# EAGLE design PiSmoker_sig_v1.1 (EAGLE 7.7.0)
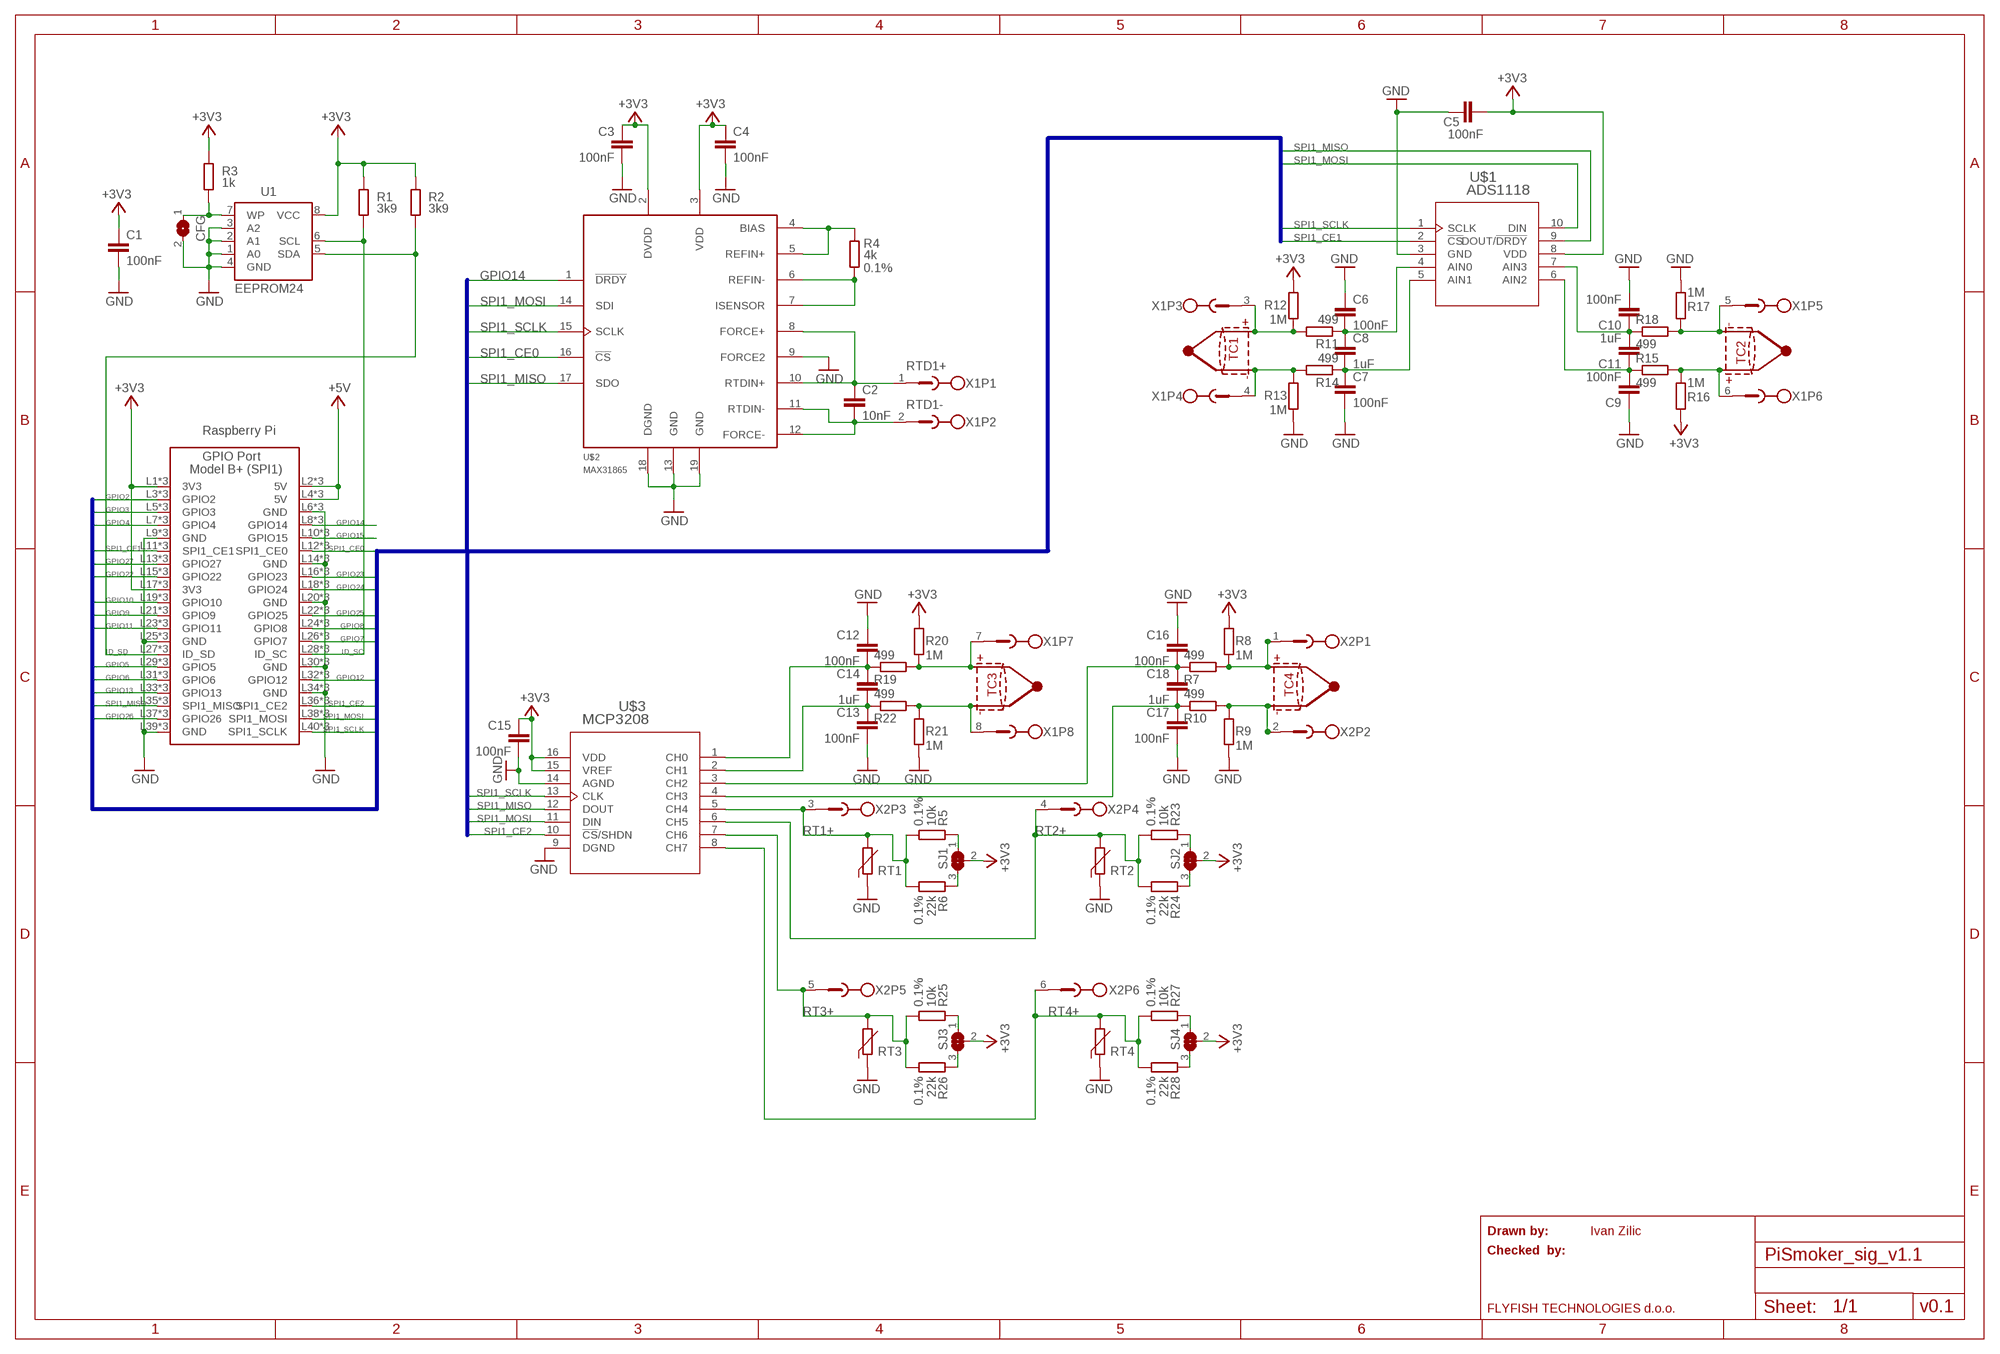
[diagram p0: schematic, sheet 1]

## Parts
C1  100nF  C-EUC0805K  [C0805K]
C2  10nF  C-EUC0805  [C0805]
C3  100nF  C-EUC0805K  [C0805K]
C4  100nF  C-EUC0805K  [C0805K]
C5  100nF  C-EUC0805K  [C0805K]
C6  100nF  C-EUC0805K  [C0805K]
C7  100nF  C-EUC0805K  [C0805K]
C8  1uF  C-EUC0805K  [C0805K]
C9  100nF  C-EUC0805K  [C0805K]
C10  100nF  C-EUC0805K  [C0805K]
C11  1uF  C-EUC0805K  [C0805K]
C12  100nF  C-EUC0805K  [C0805K]
C13  100nF  C-EUC0805K  [C0805K]
C14  1uF  C-EUC0805K  [C0805K]
C15  100nF  C-EUC0805K  [C0805K]
C16  100nF  C-EUC0805K  [C0805K]
C17  100nF  C-EUC0805K  [C0805K]
C18  1uF  C-EUC0805K  [C0805K]
CFG  SOLDERJUMPERCLOSED  [SOLDERJUMPER_CLOSEDWIRE]
R1  3k9  R-EU_M0805  [M0805]
R2  3k9  R-EU_M0805  [M0805]
R3  1k  R-EU_M0805  [M0805]
R4  4k  R-EU_R1206  [R1206]
R5  10k  R-EU_R0805  [R0805]
R6  22k  R-EU_R0805  [R0805]
R7  499  R-EU_M0805  [M0805]
R8  1M  R-EU_M0805  [M0805]
R9  1M  R-EU_M0805  [M0805]
R10  499  R-EU_M0805  [M0805]
R11  499  R-EU_M0805  [M0805]
R12  1M  R-EU_M0805  [M0805]
R13  1M  R-EU_M0805  [M0805]
R14  499  R-EU_M0805  [M0805]
R15  499  R-EU_M0805  [M0805]
R16  1M  R-EU_M0805  [M0805]
R17  1M  R-EU_M0805  [M0805]
R18  499  R-EU_M0805  [M0805]
R19  499  R-EU_M0805  [M0805]
R20  1M  R-EU_M0805  [M0805]
R21  1M  R-EU_M0805  [M0805]
R22  499  R-EU_M0805  [M0805]
R23  10k  R-EU_R0805  [R0805]
R24  22k  R-EU_R0805  [R0805]
R25  10k  R-EU_R0805  [R0805]
R26  22k  R-EU_R0805  [R0805]
R27  10k  R-EU_R0805  [R0805]
R28  22k  R-EU_R0805  [R0805]
RT1  THERMISTOR  (no package)
RT2  THERMISTOR  (no package)
RT3  THERMISTOR  (no package)
RT4  THERMISTOR  (no package)
SJ1  SOLDERJUMPER_2WAY  [SOLDERJUMPER_2WAY_ARROW_NOPASTE]
SJ2  SOLDERJUMPER_2WAY  [SOLDERJUMPER_2WAY_ARROW_NOPASTE]
SJ3  SOLDERJUMPER_2WAY  [SOLDERJUMPER_2WAY_ARROW_NOPASTE]
SJ4  SOLDERJUMPER_2WAY  [SOLDERJUMPER_2WAY_ARROW_NOPASTE]
TC1  THERMOCOUPLE  (no package)
TC2  THERMOCOUPLE  (no package)
TC3  THERMOCOUPLE  (no package)
TC4  THERMOCOUPLE  (no package)
U1  EEPROM24  [SOIC8]
U$1  ADS1118  [DGS10]
U$2  MAX31865  [SSOP20_A20-1]
U$3  MCP3208  [SOIC16-N_MC]
X1  TERMINAL_BLOCK-8PTSM0,5  [PHOENIX_PTSM0,5/8-2,5-H_SMD_R44]
X2  PHOENIX_PTS1,5-6PTSM0,5  [PHOENIX_PTSM0,5/6-2,5-H_SMD_R44]
X3  RASPI_GPIO_3B_SPI1_M20-781LOWER-876_UPPER  [M20-781_SMD_LOWER_876_UPPER]

## Nets
+3V3 [power]: C1.1 C3.1 C4.1 C5.2 C15.1 R1.2 R2.2 R3.2 R8.1 R12.1 R16.1 R20.1 SJ1.2 SJ2.2 SJ3.2 SJ4.2 U1.8(VCC) U$1.8(VDD) U$2.2(DVDD) U$2.3(VDD) U$3.15(VREF) U$3.16(VDD) X3.L1(3V3) X3.L17(3V3) X3.P1(3V3) X3.P17(3V3) X3.U1(3V3) X3.U17(3V3)
+5V: X3.L2(5V) X3.L4(5V) X3.P2(5V) X3.P4(5V) X3.U2(5V) X3.U4(5V)
GND: C1.2 C3.2 C4.2 C5.1 C6.1 C7.2 C9.1 C10.2 C12.1 C13.2 C15.2 C16.1 C17.2 CFG.2 R9.2 R13.2 R17.2 R21.2 RT1.- RT2.- RT3.- RT4.- U1.1(A0) U1.2(A1) U1.3(A2) U1.4(GND) U$1.3(GND) U$2.9(FORCE2) U$2.13(GND) U$2.18(DGND) U$2.19(GND) U$3.9(DGND) U$3.14(AGND) X3.L6(GND) X3.L9(GND) X3.L14(GND) X3.L20(GND) X3.L25(GND) X3.L30(GND) X3.L34(GND) X3.L39(GND) X3.P6(GND) X3.P9(GND) X3.P14(GND) X3.P20(GND) X3.P25(GND) X3.P30(GND) X3.P34(GND) X3.P39(GND) X3.U6(GND) X3.U9(GND) X3.U14(GND) X3.U20(GND) X3.U25(GND) X3.U30(GND) X3.U34(GND) X3.U39(GND)
GPIO2: X3.L3(GPIO2) X3.P3(GPIO2) X3.U3(GPIO2)
GPIO3: X3.L5(GPIO3) X3.P5(GPIO3) X3.U5(GPIO3)
GPIO4: X3.L7(GPIO4) X3.P7(GPIO4) X3.U7(GPIO4)
GPIO5: X3.L29(GPIO5) X3.P29(GPIO5) X3.U29(GPIO5)
GPIO6: X3.L31(GPIO6) X3.P31(GPIO6) X3.U31(GPIO6)
GPIO7: X3.L26(GPIO7) X3.P26(GPIO7) X3.U26(GPIO7)
GPIO8: X3.L24(GPIO8) X3.P24(GPIO8) X3.U24(GPIO8)
GPIO9: X3.L21(GPIO9) X3.P21(GPIO9) X3.U21(GPIO9)
GPIO10: X3.L19(GPIO10) X3.P19(GPIO10) X3.U19(GPIO10)
GPIO11: X3.L23(GPIO11) X3.P23(GPIO11) X3.U23(GPIO11)
GPIO12: X3.L32(GPIO12) X3.P32(GPIO12) X3.U32(GPIO12)
GPIO13: X3.L33(GPIO13) X3.P33(GPIO13) X3.U33(GPIO13)
GPIO14: U$2.1(!DRDY) X3.L8(GPIO14) X3.P8(GPIO14) X3.U8(GPIO14)
GPIO15: X3.L10(GPIO15) X3.P10(GPIO15) X3.U10(GPIO15)
GPIO22: X3.L15(GPIO22) X3.P15(GPIO22) X3.U15(GPIO22)
GPIO23: X3.L16(GPIO23) X3.P16(GPIO23) X3.U16(GPIO23)
GPIO24: X3.L18(GPIO24) X3.P18(GPIO24) X3.U18(GPIO24)
GPIO25: X3.L22(GPIO25) X3.P22(GPIO25) X3.U22(GPIO25)
GPIO26: X3.L37(GPIO26) X3.P37(GPIO26) X3.U37(GPIO26)
GPIO27: X3.L13(GPIO27) X3.P13(GPIO27) X3.U13(GPIO27)
ID_SC: R1.1 U1.6(SCL) X3.L28(ID_SC) X3.P28(ID_SC) X3.U28(ID_SC)
ID_SD: R2.1 U1.5(SDA) X3.L27(ID_SD) X3.P27(ID_SD) X3.U27(ID_SD)
N$1: C7.1 C8.2 R14.1 U$1.5(AIN1)
N$2: C6.2 C8.1 R11.1 U$1.4(AIN0)
N$3: CFG.1 R3.1 U1.7(WP)
N$4 [power]: R5.2 SJ1.1
N$5 [power]: R6.2 SJ1.3
N$6: C17.1 C18.2 R10.1 U$3.4(CH3)
N$7: C16.2 C18.1 R7.1 U$3.3(CH2)
N$8 [power]: R23.2 SJ2.1
N$9 [power]: R24.2 SJ2.3
N$13 [power]: R25.2 SJ3.1
N$15: R4.2 U$2.4(BIAS) U$2.5(REFIN+)
N$16: R4.1 U$2.6(REFIN-) U$2.7(ISENSOR)
N$17: C13.1 C14.2 R22.1 U$3.2(CH1)
N$18: C12.2 C14.1 R19.1 U$3.1(CH0)
N$19: C10.1 C11.2 R18.1 U$1.7(AIN3)
N$20: C9.2 C11.1 R15.1 U$1.6(AIN2)
N$21 [power]: R26.2 SJ3.3
N$23 [power]: R27.2 SJ4.1
N$24 [power]: R28.2 SJ4.3
RT1+ [power]: R5.1 R6.1 RT1.+ U$3.5(CH4) X2.3
RT2+: R23.1 R24.1 RT2.+ U$3.6(CH5) X2.4
RT3+: R25.1 R26.1 RT3.+ U$3.7(CH6) X2.5
RT4+: R27.1 R28.1 RT4.+ U$3.8(CH7) X2.6
RTD1+: C2.1 U$2.8(FORCE+) U$2.10(RTDIN+) X1.1
RTD1-: C2.2 U$2.11(RTDIN-) U$2.12(FORCE-) X1.2
SPI1_CE0: U$2.16(!CS) X3.L12(SPI1_CE0) X3.P12(SPI1_CE0) X3.U12(SPI1_CE0)
SPI1_CE1: U$1.2(!CS) X3.L11(SPI1_CE1) X3.P11(SPI1_CE1) X3.U11(SPI1_CE1)
SPI1_CE2: U$3.10(!CS!/SHDN) X3.L36(SPI1_CE2) X3.P36(SPI1_CE2) X3.U36(SPI1_CE2)
SPI1_MISO: U$1.9(DOUT/!DRDY) U$2.17(SDO) U$3.12(DOUT) X3.L35(SPI1_MISO) X3.P35(SPI1_MISO) X3.U35(SPI1_MISO)
SPI1_MOSI: U$1.10(DIN) U$2.14(SDI) U$3.11(DIN) X3.L38(SPI1_MOSI) X3.P38(SPI1_MOSI) X3.U38(SPI1_MOSI)
SPI1_SCLK: U$1.1(SCLK) U$2.15(SCLK) U$3.13(CLK) X3.L40(SPI1_SCLK) X3.P40(SPI1_SCLK) X3.U40(SPI1_SCLK)
TC1+: R11.2 R12.2 TC1.+ X1.3
TC1-: R13.1 R14.2 TC1.- X1.4
TC2+: R17.1 R18.2 TC2.- X1.5
TC2-: R15.2 R16.2 TC2.+ X1.6
TC3+: R19.2 R20.2 TC3.+ X1.7
TC3-: R21.1 R22.2 TC3.- X1.8
TC4+: R7.2 R8.2 TC4.+ X2.1
TC4-: R9.1 R10.2 TC4.- X2.2

## Buses
SPI1_SCLK,SPI1_MISO,SPI1_MOSI,SPI1_CE[0..2],GPIO[2..15],GPIO[22..27]

## Notes on the sheet
- Drawn by: | Ivan Zilic
- Checked  by:
- FLYFISH TECHNOLOGIES d.o.o. | v0.1

## Library data of the parts
C1 C3-C18 = resistor:C-EU: CAPACITOR, European symbol; DIELECTRIC: X7R
C2 = resistor:C-EU: CAPACITOR, European symbol
CFG = Custom:SOLDERJUMPER: SMD Solder JUMPER Solder the two pads together to create a connection, or remove the solder to break it. REFLOW - Use this footprint for solder paste and reflow ovens. WAVE - Use this footprint for hand-soldering (larger pads). CLOSED - Has a trace between the two pads to ensure it is closed by default. The trace needs to be cut to disable the jumper, and can be closed again by creating a solder bridge between the two pads.
R1-R3 R7-R22 = resistor:R-EU_: RESISTOR, European symbol; TOLERANCE: 5%
R4-R6 R23-R28 = resistor:R-EU_: RESISTOR, European symbol; TOLERANCE: 0.1%
RT1-RT4 = Custom:THERMISTOR; NAME_NET: True
SJ1-SJ4 = Custom:SOLDERJUMPER_2WAY: 2-Way Solder Jumper
TC1-TC4 = Custom:THERMOCOUPLE; NAME_NET: True
U1 = FLYFISH:EEPROM24
U$1 = Custom:ADS1118: ADS1118 16-bit 4-channel SE/2-channel Diff SPI ADC. VDD 2.5 - 5.5 V; COPYRIGHT: Copyright C 2015 Accelerated Designs. All rights reserved; DATASHEETURL: httpwww.ti.comlitgpnADS1118; FAMILY_NAME: PRECISION ADC <=10MSPS; GENERIC_PART_NUMBER: ADS1118; INDUSTRY_STD_PKG_TYPE: MSOP; MANUFACTURER: Texas Instruments; MANUFACTURER_PART_NUMBER: ADS1118_DGS_10; PACKAGE_DESIGNATOR: DGS; PIN_COUNT: 10; VENDOR: Texas Instruments
U$2 = Custom:MAX31865: RTD to Digital Converter The MAX31865 is a resistance-to-digital converter optimized for platinum resistance temperature detectors (RTDs). An external resistor sets the sensitivity for the RTD being used and a delta-sigma ADC converts the ratio of the RTD resistance to the reference resistance into digital form. The MAX31865’s inputs are protected against overvoltage faults up to +/-50V. Programmable detection of RTD and cable open and short conditions is included.
U$3 = Custom:MCP3208
X1 = Custom:TERMINAL_BLOCK-8: PHOENIX; P1: RTD1+; P2: RTD1-; P3: TC1+; P4: TC1-; P5: TC2-; P6: TC2+; P7: TC3+; P8: TC3-
X2 = Custom:PHOENIX_PTS1,5-6: PHOENIX; P1: TC4+; P2: TC4-; P3: RT1+; P4: RT2+; P5: RT3+; P6: RT4+
X3 = Custom:RASPI_GPIO_3B_SPI1: 2x20 header connector, all pins connected

## Net classes
0 default: width 0.152 mm, clearance 0.152 mm
1 power: width 0.305 mm, clearance 0.152 mm to class 0, clearance 0.152 mm

## Board
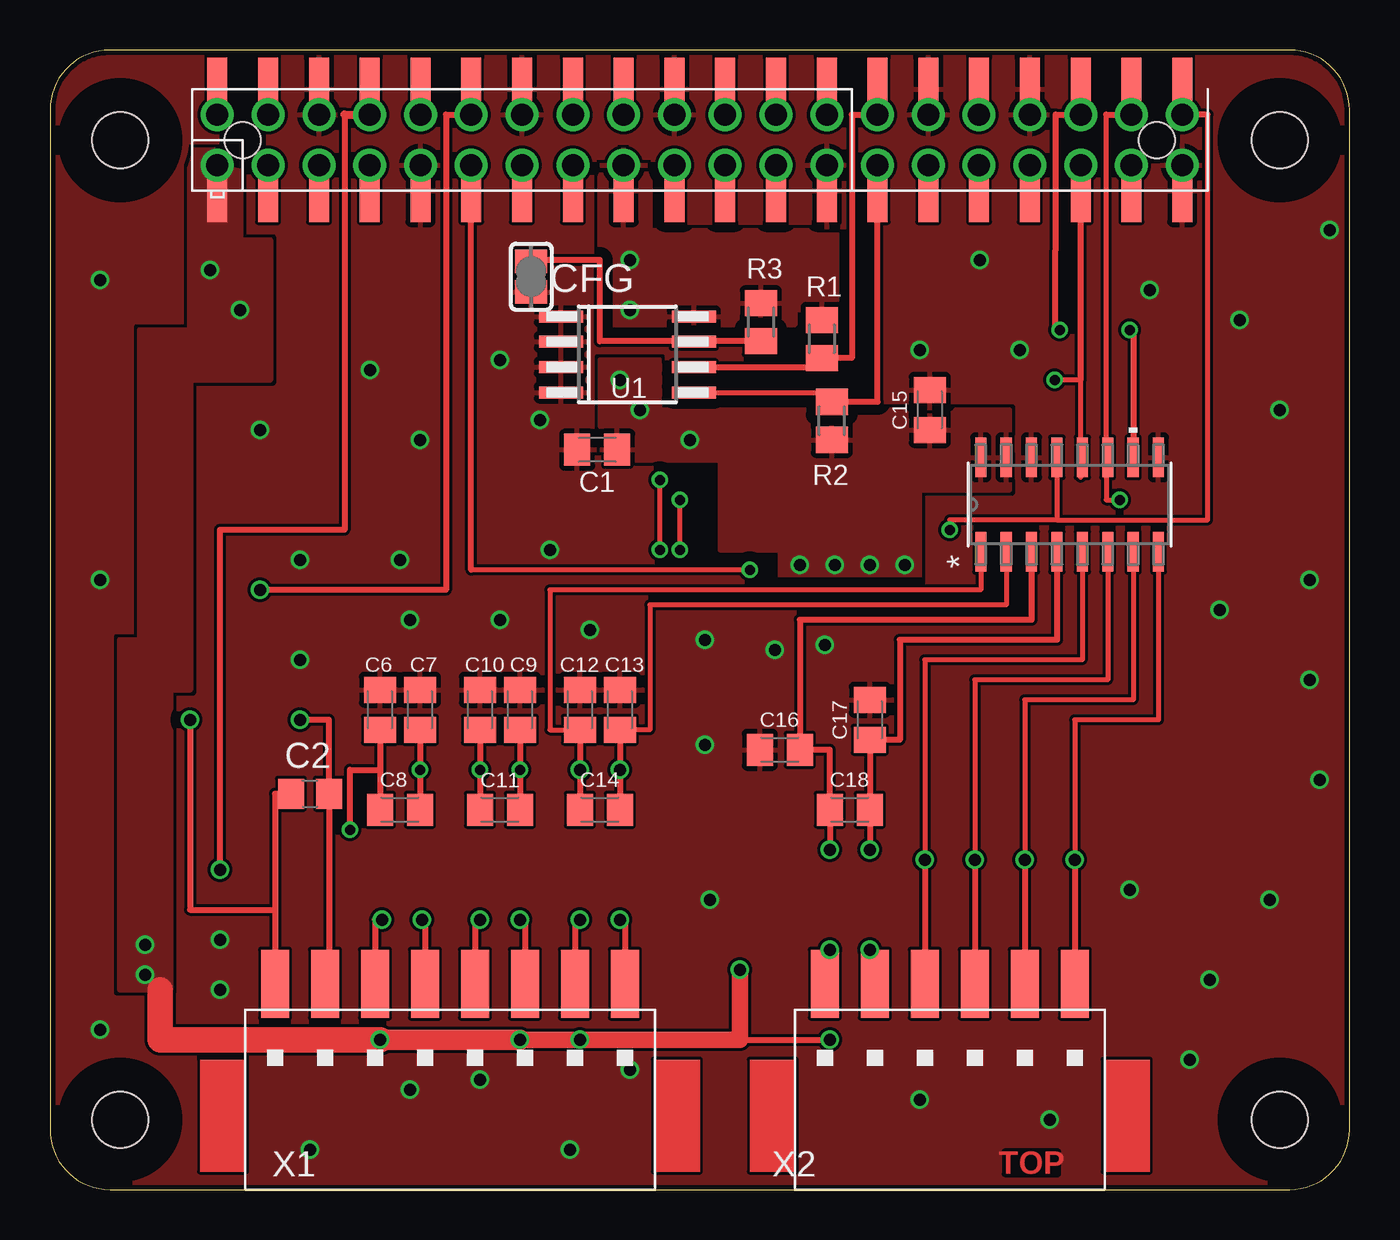
[diagram p1: board, top side]
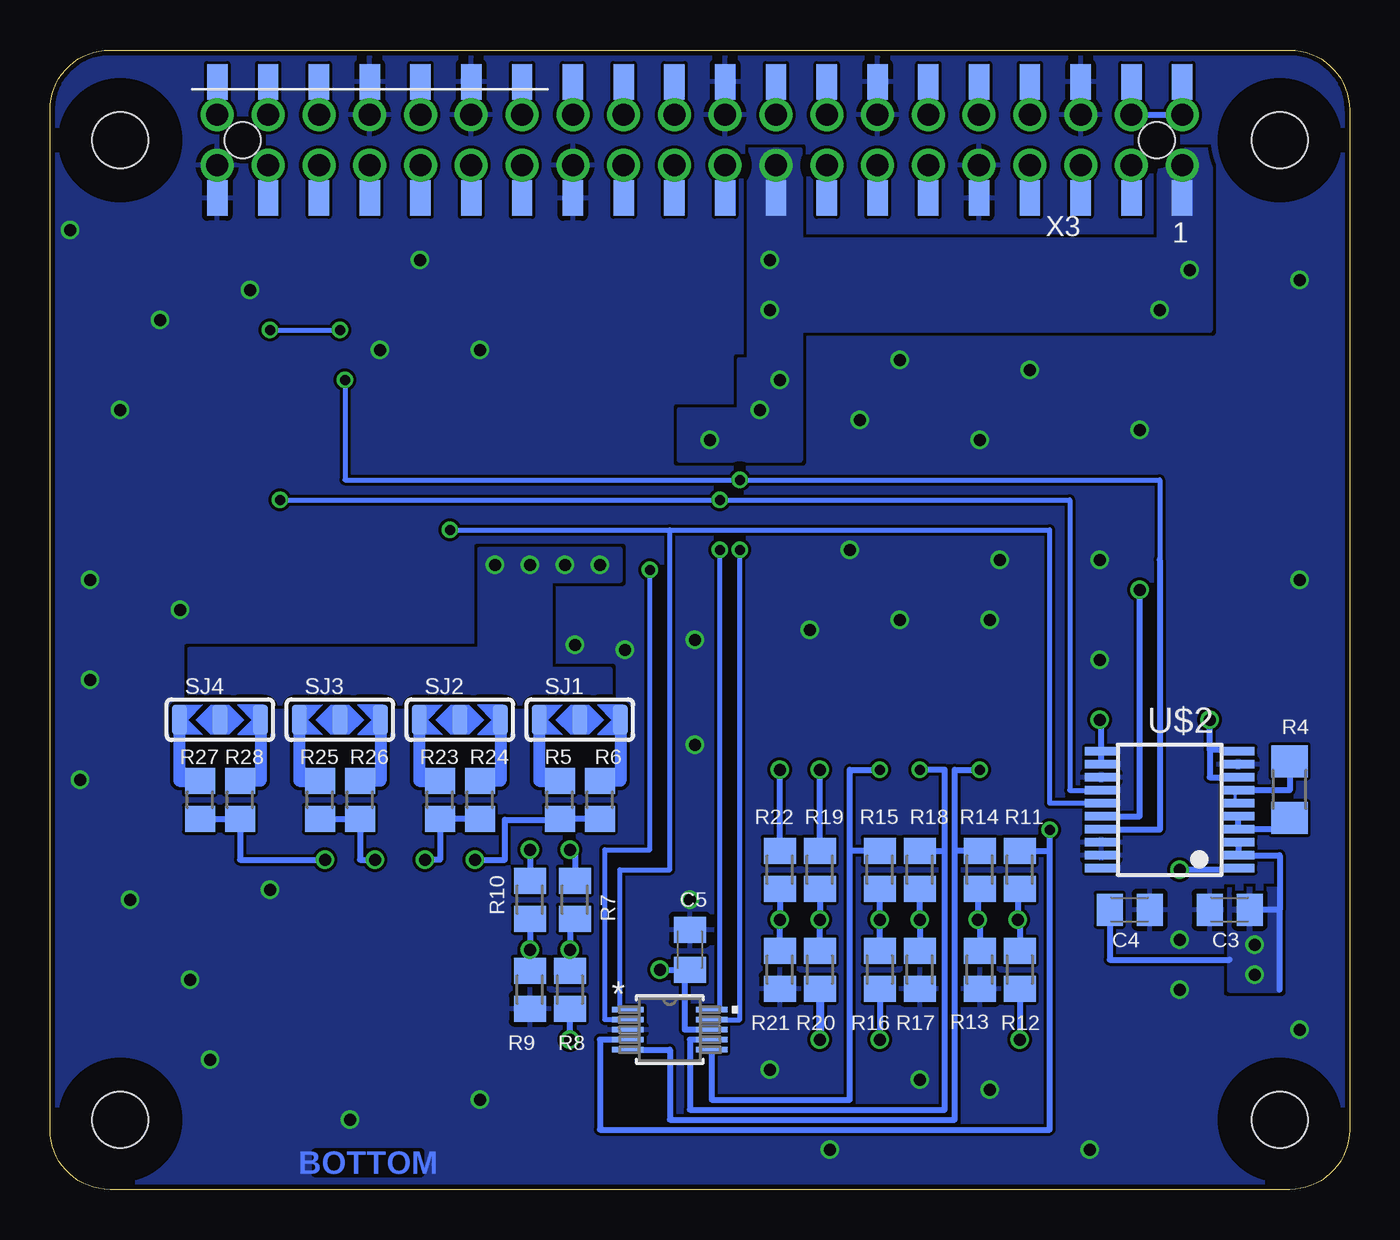
[diagram p2: board, bottom side, seen from below]

Size 65 x 57 mm. Coordinates in mm from the lower left corner, seen from the top.
Outline: 0,3 arc90 3,0 62,0 arc90 65,3 65,54 arc90 62,57 3,57 arc90 0,54 0,3
Copper layers (1*16): Top 0.035mm / dielectric 1.5mm / Bottom 0.035mm
Design rules "ITEADstudio_DRC": minimum track width 6mil, minimum drill 12mil, track to track 6mil, track to pad 6mil, pad to pad 6mil, via to via 6mil, smd to smd 0mil, copper to edge 10mil, drill to drill 10mil, minimum pad ring 10mil, minimum via ring 6mil, stop-mask expansion 2mil, vias tented up to drill 100mil, thermal gap 10mil
Holes 2.8 mm at 3.5,3.5 3.5,52.5 61.5,52.5 61.5,3.5
tRestrict: area 1.9,51 to 5,54; area 60,51 to 63,54; area 60,1.9 to 63,5; area 1.9,1.9 to 5,5
bRestrict: area 1.9,1.9 to 5,5; area 1.9,51 to 5,54; area 60,1.9 to 63,5; area 60,51 to 63,54

### Footprints (pad centres in the part's own frame; a part is rotated, then mirrored left to right if it is on the bottom)
C0805K = smd 1.3 x 1.6: 1 -1,0; 2 1,0
C0805 = smd 1.3 x 1.5: 1 -0.95,0; 2 0.95,0
SOLDERJUMPER_CLOSEDWIRE = smd 1.168 x 1.6: 1 -0.762,0; 2 0.762,0 | smd 0.635 x 0.203: WIRE 0,0
M0805 = smd 1.3 x 1.6: 1 -0.95,0; 2 0.95,0
R1206 = smd 1.6 x 1.803: 1 -1.422,0; 2 1.422,0
R0805 = smd 1.3 x 1.5: 1 -0.95,0; 2 0.95,0
SOLDERJUMPER_2WAY_ARROW_NOPASTE = smd 0.762 x 1.524: 1 -2.032,0; 2 0,0; 3 2.032,0
SOIC8 = smd 0.6 x 2.2: 1 -1.905,-3.33; 2 -0.635,-3.33; 3 0.635,-3.33; 4 1.905,-3.33; 5 1.905,3.33; 6 0.635,3.33; 7 -0.635,3.33; 8 -1.905,3.33
DGS10 = smd 1.575 x 0.279: 1 -2.095,1; 2 -2.095,0.5; 3 -2.095,0; 4 -2.095,-0.5; 5 -2.095,-1; 6 2.095,-1; 7 2.095,-0.5; 8 2.095,0; 9 2.095,0.5; 10 2.095,1
SSOP20_A20-1 = smd 0.42 x 1.625: 1 -2.925,-3.425; 2 -2.275,-3.425; 3 -1.625,-3.425; 4 -0.975,-3.425; 5 -0.325,-3.425; 6 0.325,-3.425; 7 0.975,-3.425; 8 1.625,-3.425; 9 2.275,-3.425; 10 2.925,-3.425; 11 2.925,3.425; 12 2.275,3.425; 13 1.625,3.425; 14 0.975,3.425; 15 0.325,3.425; 16 -0.325,3.425; 17 -0.975,3.425; 18 -1.625,3.425; 19 -2.275,3.425; 20 -2.925,3.425
SOIC16-N_MC = smd 1.981 x 0.559: 1 -2.362,4.445; 2 -2.362,3.175; 3 -2.362,1.905; 4 -2.362,0.635; 5 -2.362,-0.635; 6 -2.362,-1.905; 7 -2.362,-3.175; 8 -2.362,-4.445; 9 2.362,-4.445; 10 2.362,-3.175; 11 2.362,-1.905; 12 2.362,-0.635; 13 2.362,0.635; 14 2.362,1.905; 15 2.362,3.175; 16 2.362,4.445
PHOENIX_PTSM0,5/8-2,5-H_SMD_R44 = smd 1.4 x 3.4: 1 -8.75,10.3; 2 -6.25,10.3; 3 -3.75,10.3; 4 -1.25,10.3; 5 1.25,10.3; 6 3.75,10.3; 7 6.25,10.3; 8 8.75,10.3
PHOENIX_PTSM0,5/6-2,5-H_SMD_R44 = smd 1.4 x 3.4: 1 -6.25,10.3; 2 -3.75,10.3; 3 -1.25,10.3; 4 1.25,10.3; 5 3.75,10.3; 6 6.25,10.3
M20-781_SMD_LOWER_876_UPPER = smd 1.02 x 1.78 bottom: L1 -24.13,-2.91; L2 -24.13,2.91; L3 -21.59,-2.91; L4 -21.59,2.91; L5 -19.05,-2.91; L6 -19.05,2.91; L7 -16.51,-2.91; L8 -16.51,2.91; L9 -13.97,-2.91; L10 -13.97,2.91; L11 -11.43,-2.91; L12 -11.43,2.91; L13 -8.89,-2.91; L14 -8.89,2.91; L15 -6.35,-2.91; L16 -6.35,2.91; L17 -3.81,-2.91; L18 -3.81,2.91; L19 -1.27,-2.91; L20 -1.27,2.91; L21 1.27,-2.91; L22 1.27,2.91; L23 3.81,-2.91; L24 3.81,2.91; L25 6.35,-2.91; L26 6.35,2.91; L27 8.89,-2.91; L28 8.89,2.91; L29 11.43,-2.91; L30 11.43,2.91; L31 13.97,-2.91; L32 13.97,2.91; L33 16.51,-2.91; L34 16.51,2.91; L35 19.05,-2.91; L36 19.05,2.91; L37 21.59,-2.91; L38 21.59,2.91; L39 24.13,-2.91; L40 24.13,2.91 | drill 1.1: P1 -24.13,-1.27; P2 -24.13,1.27; P3 -21.59,-1.27; P4 -21.59,1.27; P5 -19.05,-1.27; P6 -19.05,1.27; P7 -16.51,-1.27; P8 -16.51,1.27; P9 -13.97,-1.27; P10 -13.97,1.27; P11 -11.43,-1.27; P12 -11.43,1.27; P13 -8.89,-1.27; P14 -8.89,1.27; P15 -6.35,-1.27; P16 -6.35,1.27; P17 -3.81,-1.27; P18 -3.81,1.27; P19 -1.27,-1.27; P20 -1.27,1.27; P21 1.27,-1.27; P22 1.27,1.27; P23 3.81,-1.27; P24 3.81,1.27; P25 6.35,-1.27; P26 6.35,1.27; P27 8.89,-1.27; P28 8.89,1.27; P29 11.43,-1.27; P30 11.43,1.27; P31 13.97,-1.27; P32 13.97,1.27; P33 16.51,-1.27; P34 16.51,1.27; P35 19.05,-1.27; P36 19.05,1.27; P37 21.59,-1.27; P38 21.59,1.27; P39 24.13,-1.27; P40 24.13,1.27 | smd 1 x 3.15: U1 -24.13,-2.525; U2 -24.13,2.525; U3 -21.59,-2.525; U4 -21.59,2.525; U5 -19.05,-2.525; U6 -19.05,2.525; U7 -16.51,-2.525; U8 -16.51,2.525; U9 -13.97,-2.525; U10 -13.97,2.525; U11 -11.43,-2.525; U12 -11.43,2.525; U13 -8.89,-2.525; U14 -8.89,2.525; U15 -6.35,-2.525; U16 -6.35,2.525; U17 -3.81,-2.525; U18 -3.81,2.525; U19 -1.27,-2.525; U20 -1.27,2.525; U21 1.27,-2.525; U22 1.27,2.525; U23 3.81,-2.525; U24 3.81,2.525; U25 6.35,-2.525; U26 6.35,2.525; U27 8.89,-2.525; U28 8.89,2.525; U29 11.43,-2.525; U30 11.43,2.525; U31 13.97,-2.525; U32 13.97,2.525; U33 16.51,-2.525; U34 16.51,2.525; U35 19.05,-2.525; U36 19.05,2.525; U37 21.59,-2.525; U38 21.59,2.525; U39 24.13,-2.525; U40 24.13,2.525 | hole 1.8: -22.86,0; 22.86,0

### Placement (x,y rotation side)
C1  27.37,37.01 180 top
C2  13,19.8 0 top
C3  6,14 180 bottom
C4  11,14 0 bottom
C5  33,12 270 bottom
C6  16.5,24 270 top
C7  18.5,24 90 top
C8  17.5,19 0 top
C9  23.5,24 270 top
C10  21.5,24 90 top
C11  22.5,19 180 top
C12  26.5,24 270 top
C13  28.5,24 90 top
C14  27.5,19 0 top
C15  44,39 90 top
C16  36.5,22 0 top
C17  41,23.5 90 top
C18  40,19 0 top
CFG  24.07,45.66 270 top
R1  38.6,42.55 90 top
R2  39.1,38.45 270 top
R3  35.56,43.39 90 top
R4  3,20 270 bottom
R5  39.5,19.5 90 bottom
R6  37.5,19.5 90 bottom
R7  38.75,14.5 270 bottom
R8  39,10 90 bottom
R9  41,10 270 bottom
R10  41,14.5 270 bottom
R11  16.5,16 270 bottom
R12  16.5,11 90 bottom
R13  18.5,11 270 bottom
R14  18.5,16 270 bottom
R15  23.5,16 270 bottom
R16  23.5,11 90 bottom
R17  21.5,11 270 bottom
R18  21.5,16 270 bottom
R19  26.5,16 270 bottom
R20  26.5,11 90 bottom
R21  28.5,11 270 bottom
R22  28.5,16 270 bottom
R23  45.5,19.5 90 bottom
R24  43.5,19.5 90 bottom
R25  51.5,19.5 90 bottom
R26  49.5,19.5 90 bottom
R27  57.5,19.5 90 bottom
R28  55.5,19.5 90 bottom
SJ1  38.5,23.5 0 bottom
SJ2  44.5,23.5 0 bottom
SJ3  50.5,23.5 0 bottom
SJ4  56.5,23.5 0 bottom
U1  28.88,41.77 270 top
U$1  34,8 0 bottom
U$2  9,19 90 bottom
U$3  51,34.26 90 top
X1  20,0 0 top
X2  45,0 0 top
X3  32.5,52.5 0 top

### Tracks (layer width: path | path; a pad name or v marks a point on that pad's centre or on a via)
+3V3  (via drill 0.6)
  Top 0.305: 34.5,7.5 v39,7.5
  Top 0.813: v23.5,7.5 v26.5,7.5 34.5,7.5 v34.5,11
  Top 1.016: v16.5,7.5 v23.5,7.5
  Top 1.27: v16.5,7.5 5.5,7.5 5.5,10
  Bottom 0.305: U$2.3 U$2.2 3.5,16.73 3.5,14 | 3.5,14 C3.1 | 3.5,10 3.5,14 | R16.1 v23.5,7.5 | C4.1 12,11.5 6,11.5 | R12.1 v16.5,7.5 | v34.5,11 C5.2 33.25,10.75 33.25,8 U$1.8 | v39,7.5 R8.1
  Bottom 0.406: R20.1 v26.5,7.5
  other vias: 28.5,40.5 29.5,39 32,37.5 37.5,31.25 39.25,31.25 41,31.25 42.75,31.25 8,46 9.5,44 29,46.5 29,44 4.75,12.25 4.75,10.75
  pour Bottom (isolate 0.5, no thermals): 7,52 7,43 27.5,43 27.5,36.5 33.5,36.5 33.5,39 30.5,39 30.5,41.5 30,41.5 30,52 27.5,52 27.5,47.5 9.5,47.5 9.5,52
  pour Top (isolate 0.5, no thermals): 7,52 9.5,52 9.5,47.5 11,47.5 11,40.5 7,40.5 7,25 6,25 6,10 3.5,10 3.5,27.5 4.5,27.5 4.5,43 7,43
  pour Top (isolate 0.5): 48,39 30.5,39 30.5,41.5 27.5,41.5 27.5,36.5 33.5,36.5 33.5,32 36.5,32 36.5,30.5 43.5,30.5 43.5,35 48,35
  pour Top (isolate 0.5): 27.5,43.25 27.5,52 30,52 30,48 39.5,48 39.5,44 37.25,44 37.25,43.25
  pour Bottom (isolate 0.5): 36.5,32 43.5,32 43.5,27 58,27 58,23 37,23 37,26 40,26 40,30.5 36.5,30.5
  pour Bottom: 6,15 6,10 3.5,10 3.5,15
+5V
  Bottom 0.305: X3.P4 X3.P2
GND  (via drill 0.6)
  other vias: 22.5,41.5 24.5,38.5 16,41 18.5,37.5 2.5,45.5 10.5,38 2.5,30.5 29,6 12.5,31.5 12.5,26.5 22.5,28.5 18,28.5 27,28 33,14.5 32.75,27.5 32.75,22.25 54,15 58,10.5 61,14.5 57,6.5 63,25.5 63.5,20.5 58.5,29 63,30.5 61.5,39 59.5,43.5 64,48 43.5,42 46.5,46.5 48.5,42 55,45 8.5,12.5 2.5,8 13,2 26,2 43.5,4.5 50,3.5 36.25,27 38.75,27.25 17.5,31.5 25,32 18,5 21.5,5.5 8.5,10
  pour Bottom (rank 6): 0,3 arc90 3,0 62,0 arc90 65,3 65,54 arc90 62,57 3,57 arc90 0,54 0,18.5
  pour Top (rank 6): 0,3 arc90 3,0 62,0 arc90 65,3 65,54 arc90 62,57 3,57 arc90 0,54 0,18.5
GPIO14  (via drill 0.6)
  Top 0.305: 14.73,53.77 14.73,33 8.5,33 v8.5,16
  Top 0.406: 14.73,53.77 X3.P8
  Bottom 0.305: U$2.1 5.58,16 v8.5,16
ID_SC
  Top 0.305: X3.P28 40.1,53.77 40.1,41.6 R1.1 38.6,41.13 U1.6
ID_SD
  Top 0.254: U1.5 39.1,39.86 R2.1
  Top 0.305: 39.1,39.85 R2.1 41.39,39.4 X3.U27
N$1  (via drill 0.5)
  Top 0.305: C7.1 v18.5,21 C8.2
  Bottom 0.305: U$1.5 34,7 34,3.5 19.75,3.5 19.75,16.95 | v18.5,21 19.75,21 19.75,17 19.75,16.95 | R14.1 19.75,16.95
N$2  (via drill 0.5)
  Top 0.305: C6.2 16.5,21 | 16.5,21 C8.1 | v15,18 15,21 16.5,21
  Bottom 0.305: U$1.4 37.5,7.5 37.5,3 15,3 15,16.95 | v15,18 15,17 15,16.95 | R11.1 15,16.95
N$3
  Top 0.305: R3.1 32.21,42.44 | 32.21,42.44 U1.7 | 32.21,42.44 27.5,42.44 27.5,46.5 24.07,46.5 CFG.1
N$4
  Bottom 0.61: SJ1.1 40.53,20.45 R5.2
N$5
  Bottom 0.61: SJ1.3 36.47,20.45 R6.2
N$6  (via drill 0.6)
  Top 0.305: U$3.4 50.37,27.5 42.5,27.5 42.5,22.5 C17.1 C18.2 v41,17
  Bottom 0.305: v41,17 R10.1
N$7  (via drill 0.6)
  Top 0.305: U$3.3 49.09,28.5 37.5,28.5 C16.2 39,22 C18.1 v39,17
  Bottom 0.305: v39,17 38.75,17 R7.1
N$8
  Bottom 0.61: SJ2.1 46.53,20.45 R23.2
N$9
  Bottom 0.61: SJ2.3 42.47,20.45 R24.2
N$13
  Bottom 0.61: SJ3.1 52.53,20.45 R25.2
N$15
  Bottom 0.305: R4.2 3,18.02 U$2.4 U$2.5
N$16
  Bottom 0.152: U$2.6 5.75,19.5 5.75,20 U$2.7
  Bottom 0.305: R4.1 3,19.98 U$2.7
N$17  (via drill 0.6)
  Top 0.254: U$3.2 47.83,29.25 30,29.25 30,23 C13.1
  Top 0.305: C13.1 v28.5,21 C14.2
  Bottom 0.305: R22.1 v28.5,21
N$18  (via drill 0.6)
  Top 0.254: U$3.1 46.55,30 25,30 25,23 C12.2
  Top 0.305: C12.2 v26.5,21 C14.1
  Bottom 0.305: 26.5,17 R19.1 v26.5,21
N$19  (via drill 0.5)
  Top 0.305: C10.1 v21.5,21 C11.2
  Bottom 0.305: U$1.7 33,7.5 33,4 20.25,4 20.25,16.95 | v21.5,21 20.25,21 20.25,17 20.25,16.95 | R18.1 20.25,16.95
N$20  (via drill 0.5)
  Top 0.305: C9.2 v23.5,21 C11.1
  Bottom 0.305: U$1.6 31.9,4.5 25,4.5 25,16.95 | v23.5,21 25,21 25,17 25,16.95 | R15.1 25,16.95
N$21
  Bottom 0.61: SJ3.3 48.47,20.45 R26.2
N$23
  Bottom 0.61: SJ4.1 58.53,20.45 R27.2
N$24
  Bottom 0.61: SJ4.3 54.47,20.45 R28.2
RT1+  (via drill 0.6)
  Top 0.254: U$3.5 51.63,26.5 43.75,26.5 v43.75,16.5
  Top 0.305: v43.75,16.5 X2.3
  Bottom 0.305: R6.1 R5.1 39.5,18.5 42.25,18.5 42.25,16.5 v43.75,16.5
RT2+  (via drill 0.6)
  Top 0.254: U$3.6 52.91,25.5 46.25,25.5 v46.25,16.5
  Top 0.305: v46.25,16.5 X2.4
  Bottom 0.305: R24.1 R23.1 45.5,16.5 v46.25,16.5
RT3+  (via drill 0.6)
  Top 0.254: U$3.7 54.17,24.5 48.75,24.5 v48.75,16.5
  Top 0.305: v48.75,16.5 X2.5
  Bottom 0.305: R25.1 R26.1 49.5,16.5 v48.75,16.5
RT4+  (via drill 0.6)
  Top 0.254: U$3.8 55.45,23.5 51.25,23.5 v51.25,16.5
  Top 0.305: v51.25,16.5 X2.6
  Bottom 0.305: R27.1 R28.1 55.5,16.5 v51.25,16.5
RTD1+  (via drill 0.6)
  Top 0.305: C2.1 11.25,19.8 11.25,14 | 11.25,14 X1.1 | v7,23.5 7,14 11.25,14
  Bottom 0.305: U$2.10 5.58,22 7,22 | 7,22 7,20.62 U$2.8 | 7,22 v7,23.5
RTD1-  (via drill 0.6)
  Top 0.305: v12.5,23.5 13.95,23.5 C2.2 13.95,10.3 X1.2
  Bottom 0.305: v12.5,23.5 12.43,23.5 U$2.11 U$2.12
SPI1_CE0  (via drill 0.6)
  Top 0.305: v10.5,30 19.81,30 19.81,53.77 X3.P12
  Bottom 0.305: U$2.16 10.5,18.68 v10.5,30
SPI1_CE1  (via drill 0.5)
  Top 0.254: v35,31 21.07,31
  Top 0.305: 21.07,31 X3.P11
  Bottom 0.254: U$1.2 37.25,8.5 37.25,17 35,17 v35,31
SPI1_CE2  (via drill 0.5)
  Top 0.305: X3.P36 50.29,53.77 50.29,47.5 50.29,47 50.29,43 v50.5,43 | v54,43 54.17,43 U$3.10
  Bottom 0.254: v54,43 v50.5,43
SPI1_MISO  (via drill 0.5)
  Top 0.254: U$3.12 51.55,35.62 51.55,40.5 v50.25,40.5 | v30.5,32 v30.5,35.5
  Top 0.305: 51.55,40.5 X3.P35
  Bottom 0.254: v50.25,40.5 50.25,35.5 v30.5,35.5 9.5,35.5 9.5,31.5 | U$1.9 30.5,8.5 v30.5,32
  Bottom 0.305: 9.5,31.5 9.5,18 12.43,18 U$2.17
SPI1_MOSI  (via drill 0.5)
  Top 0.254: U$3.11 52.83,35.62 | 52.83,35.62 52.83,53.77 | 52.83,35.62 52.83,34.5 v53.5,34.5 | v31.5,32 v31.5,34.5
  Top 0.305: 52.83,53.77 X3.P38
  Bottom 0.254: v53.5,34.5 v31.5,34.5 14,34.5 14,19.98 U$2.14 | U$1.10 31.5,9 v31.5,32
SPI1_SCLK  (via drill 0.5)
  Top 0.254: U$3.13 50.37,33.5 | 50.37,33.5 57.91,33.5 57.91,53.77 | 50.37,33.5 45,33.5 v45,33
  Top 0.305: 57.91,53.77 X3.P40
  Bottom 0.254: U$2.15 15,19.32 15,33 34,33 | v45,33 34,33 | U$1.1 36.5,9 36.5,16 34,16 34,33
TC1+  (via drill 0.6)
  Top 0.305: v16.6,13.5 16.25,13.5 X1.3
  Bottom 0.305: R11.2 16.6,15.05 v16.6,13.5 16.5,13.5 R12.2
TC1-  (via drill 0.6)
  Top 0.305: v18.6,13.5 18.75,13.5 X1.4
  Bottom 0.305: R14.2 18.6,15.05 v18.6,13.5 18.5,13.5 R13.1
TC2+  (via drill 0.6)
  Top 0.305: v21.5,13.5 21.25,13.5 X1.5
  Bottom 0.305: R17.1 v21.5,13.5 R18.2
TC2-  (via drill 0.6)
  Top 0.305: v23.5,13.5 23.75,13.5 X1.6
  Bottom 0.305: R16.2 v23.5,13.5 R15.2
TC3+  (via drill 0.6)
  Top 0.305: v26.5,13.5 26.25,13.5 X1.7
  Bottom 0.305: R20.2 v26.5,13.5 R19.2
TC3-  (via drill 0.6)
  Top 0.305: v28.5,13.5 28.75,13.5 X1.8
  Bottom 0.305: R21.1 v28.5,13.5 R22.2
TC4+  (via drill 0.6)
  Top 0.305: v39,12 38.75,12 X2.1
  Bottom 0.305: R8.2 v39,12 39,13.55 R7.2
TC4-  (via drill 0.6)
  Top 0.305: v41,12 41.25,12 X2.2
  Bottom 0.305: R9.1 v41,12 R10.2

### Text on the board
Top: TOP
Bottom: BOTTOM